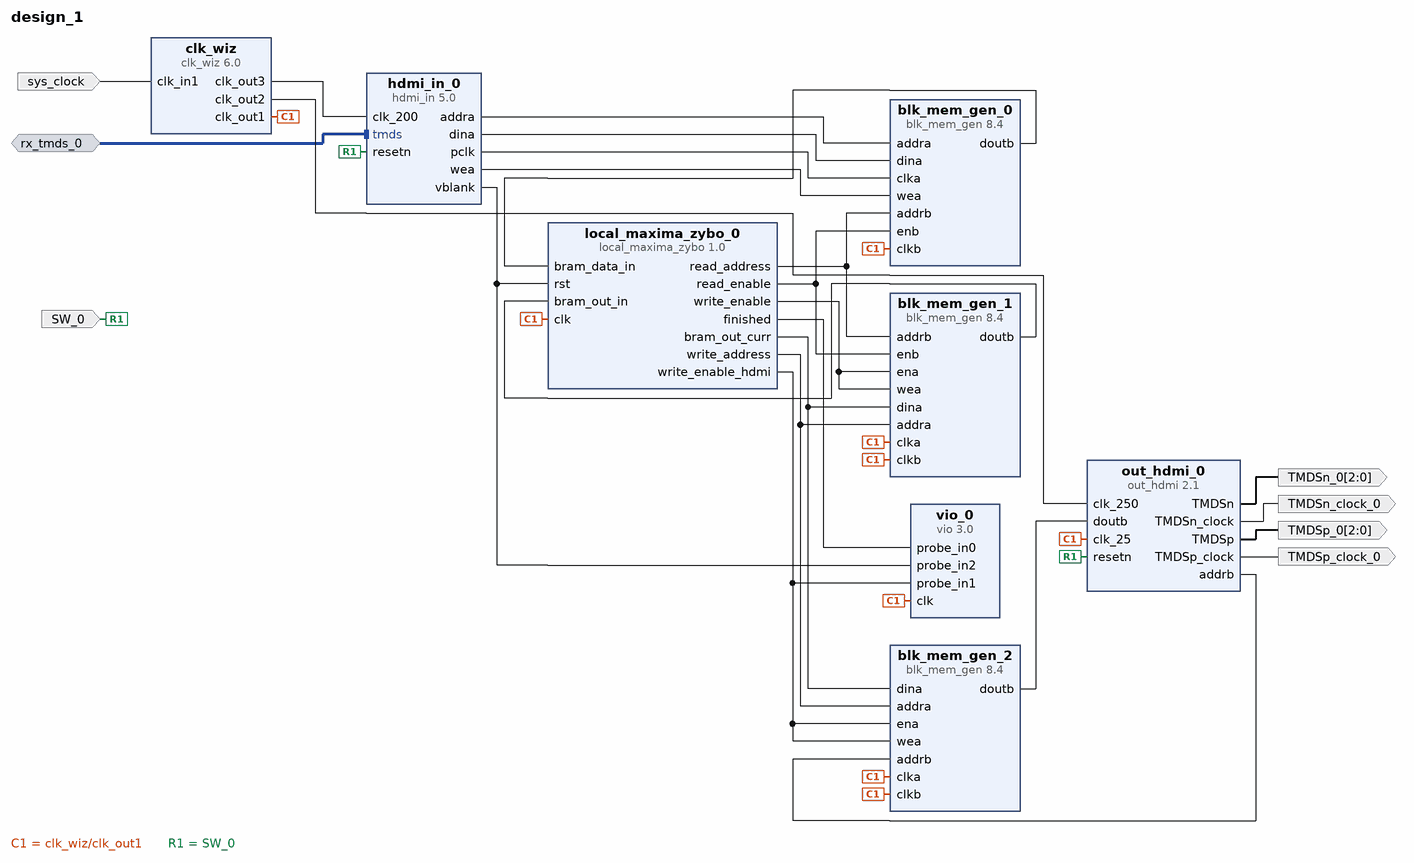
[diagram p0: block diagram of the top level]
# Vivado block design design_1, xc7z020clg400-1, Vivado 2022.2
create_bd_design design_1

create_bd_intf_port -mode Slave -vlnv digilentinc.com:interface:tmds_rtl:1.0 rx_tmds_0
create_bd_port -dir I -type clk sys_clock
set_property -dict {CONFIG.FREQ_HZ 125000000 CONFIG.PHASE 0.0} [get_bd_ports sys_clock]
create_bd_port -dir O -from 2 -to 0 TMDSp_0
create_bd_port -dir O -from 2 -to 0 TMDSn_0
create_bd_port -dir O -type clk TMDSp_clock_0
create_bd_port -dir O -type clk TMDSn_clock_0
create_bd_port -dir I -type rst SW_0

create_bd_cell -type ip -vlnv xilinx.com:ip:blk_mem_gen:8.4 blk_mem_gen_0
set_property -dict [list \
  CONFIG.Coe_File ../../../../../../bram_in_hdmi_test1.coe \
  CONFIG.Enable_A Always_Enabled \
  CONFIG.Load_Init_File true \
  CONFIG.Memory_Type Simple_Dual_Port_RAM \
  CONFIG.Write_Depth_A 480 \
  CONFIG.Write_Width_A 3840 \
  CONFIG.use_bram_block Stand_Alone \
] [get_bd_cells blk_mem_gen_0]
create_bd_cell -type ip -vlnv user.org:user:local_maxima_zybo:1.0 local_maxima_zybo_0
create_bd_cell -type ip -vlnv xilinx.com:ip:blk_mem_gen:8.4 blk_mem_gen_1
set_property -dict [list \
  CONFIG.Memory_Type Simple_Dual_Port_RAM \
  CONFIG.Write_Depth_A 480 \
  CONFIG.Write_Width_A 640 \
  CONFIG.use_bram_block Stand_Alone \
] [get_bd_cells blk_mem_gen_1]
create_bd_cell -type ip -vlnv xilinx.com:ip:vio:3.0 vio_0
set_property -dict {CONFIG.C_NUM_PROBE_IN 3 CONFIG.C_NUM_PROBE_OUT 0} [get_bd_cells vio_0]
create_bd_cell -type ip -vlnv xilinx.com:ip:blk_mem_gen:8.4 blk_mem_gen_2
set_property -dict [list \
  CONFIG.Enable_B Always_Enabled \
  CONFIG.Memory_Type Simple_Dual_Port_RAM \
  CONFIG.Write_Depth_A 480 \
  CONFIG.Write_Width_A 640 \
  CONFIG.use_bram_block Stand_Alone \
] [get_bd_cells blk_mem_gen_2]
create_bd_cell -type ip -vlnv user.org:user:out_hdmi:2.1 out_hdmi_0
create_bd_cell -type ip -vlnv xilinx.com:ip:clk_wiz:6.0 clk_wiz
set_property -dict [list \
  CONFIG.CLKIN1_JITTER_PS 80.0 \
  CONFIG.CLKIN2_JITTER_PS 133.33 \
  CONFIG.CLKOUT1_JITTER 165.419 \
  CONFIG.CLKOUT1_PHASE_ERROR 96.948 \
  CONFIG.CLKOUT1_REQUESTED_OUT_FREQ 25 \
  CONFIG.CLKOUT2_JITTER 104.759 \
  CONFIG.CLKOUT2_PHASE_ERROR 96.948 \
  CONFIG.CLKOUT2_REQUESTED_OUT_FREQ 250 \
  CONFIG.CLKOUT2_USED true \
  CONFIG.CLKOUT3_JITTER 109.241 \
  CONFIG.CLKOUT3_PHASE_ERROR 96.948 \
  CONFIG.CLKOUT3_REQUESTED_OUT_FREQ 200 \
  CONFIG.CLKOUT3_USED true \
  CONFIG.CLK_IN1_BOARD_INTERFACE sys_clock \
  CONFIG.MMCM_CLKFBOUT_MULT_F 8.000 \
  CONFIG.MMCM_CLKIN1_PERIOD 8.000 \
  CONFIG.MMCM_CLKIN2_PERIOD 10.000 \
  CONFIG.MMCM_CLKOUT0_DIVIDE_F 40.000 \
  CONFIG.MMCM_CLKOUT1_DIVIDE 4 \
  CONFIG.MMCM_CLKOUT2_DIVIDE 5 \
  CONFIG.MMCM_DIVCLK_DIVIDE 1 \
  CONFIG.NUM_OUT_CLKS 3 \
  CONFIG.SECONDARY_SOURCE Single_ended_clock_capable_pin \
  CONFIG.USE_BOARD_FLOW true \
  CONFIG.USE_INCLK_SWITCHOVER false \
] [get_bd_cells clk_wiz]
create_bd_cell -type ip -vlnv user.org:user:hdmi_in:5.0 hdmi_in_0

# ---- connections ----

connect_bd_intf_net -intf_net rx_tmds_0_1 [get_bd_intf_ports rx_tmds_0] [get_bd_intf_pins hdmi_in_0/tmds]
connect_bd_net [get_bd_pins clk_wiz/clk_out1] \
  [get_bd_pins vio_0/clk] [get_bd_pins blk_mem_gen_0/clkb] [get_bd_pins local_maxima_zybo_0/clk] \
  [get_bd_pins blk_mem_gen_1/clkb] [get_bd_pins blk_mem_gen_1/clka] [get_bd_pins blk_mem_gen_2/clka] \
  [get_bd_pins blk_mem_gen_2/clkb] [get_bd_pins out_hdmi_0/clk_25]
connect_bd_net [get_bd_pins blk_mem_gen_0/doutb] [get_bd_pins local_maxima_zybo_0/bram_data_in]
connect_bd_net [get_bd_pins blk_mem_gen_1/doutb] [get_bd_pins local_maxima_zybo_0/bram_out_in]
connect_bd_net [get_bd_pins blk_mem_gen_2/doutb] [get_bd_pins out_hdmi_0/doutb]
connect_bd_net [get_bd_pins clk_wiz/clk_out2] [get_bd_pins out_hdmi_0/clk_250]
connect_bd_net [get_bd_pins clk_wiz/clk_out3] [get_bd_pins hdmi_in_0/clk_200]
connect_bd_net [get_bd_pins hdmi_in_0/addra] [get_bd_pins blk_mem_gen_0/addra]
connect_bd_net [get_bd_pins hdmi_in_0/dina] [get_bd_pins blk_mem_gen_0/dina]
connect_bd_net [get_bd_pins hdmi_in_0/pclk] [get_bd_pins blk_mem_gen_0/clka]
connect_bd_net [get_bd_pins hdmi_in_0/vblank] [get_bd_pins vio_0/probe_in2] [get_bd_pins local_maxima_zybo_0/rst]
connect_bd_net [get_bd_pins hdmi_in_0/wea] [get_bd_pins blk_mem_gen_0/wea]
connect_bd_net [get_bd_pins local_maxima_zybo_0/bram_out_curr] [get_bd_pins blk_mem_gen_1/dina] [get_bd_pins blk_mem_gen_2/dina]
connect_bd_net [get_bd_pins local_maxima_zybo_0/finished] [get_bd_pins vio_0/probe_in0]
connect_bd_net [get_bd_pins local_maxima_zybo_0/read_address] [get_bd_pins blk_mem_gen_0/addrb] [get_bd_pins blk_mem_gen_1/addrb]
connect_bd_net [get_bd_pins local_maxima_zybo_0/read_enable] [get_bd_pins blk_mem_gen_0/enb] [get_bd_pins blk_mem_gen_1/enb]
connect_bd_net [get_bd_pins local_maxima_zybo_0/write_address] [get_bd_pins blk_mem_gen_1/addra] [get_bd_pins blk_mem_gen_2/addra]
connect_bd_net [get_bd_pins local_maxima_zybo_0/write_enable] [get_bd_pins blk_mem_gen_1/ena] [get_bd_pins blk_mem_gen_1/wea]
connect_bd_net [get_bd_pins local_maxima_zybo_0/write_enable_hdmi] \
  [get_bd_pins vio_0/probe_in1] [get_bd_pins blk_mem_gen_2/ena] [get_bd_pins blk_mem_gen_2/wea]
connect_bd_net [get_bd_pins out_hdmi_0/TMDSn] [get_bd_ports TMDSn_0]
connect_bd_net [get_bd_pins out_hdmi_0/TMDSn_clock] [get_bd_ports TMDSn_clock_0]
connect_bd_net [get_bd_pins out_hdmi_0/TMDSp] [get_bd_ports TMDSp_0]
connect_bd_net [get_bd_pins out_hdmi_0/TMDSp_clock] [get_bd_ports TMDSp_clock_0]
connect_bd_net [get_bd_pins out_hdmi_0/addrb] [get_bd_pins blk_mem_gen_2/addrb]
connect_bd_net -net resetn_0_1 [get_bd_ports SW_0] [get_bd_pins out_hdmi_0/resetn] [get_bd_pins hdmi_in_0/resetn]
connect_bd_net [get_bd_ports sys_clock] [get_bd_pins clk_wiz/clk_in1]

validate_bd_design
save_bd_design
